# EAGLE schematic untitled (EAGLE 9.6.2)
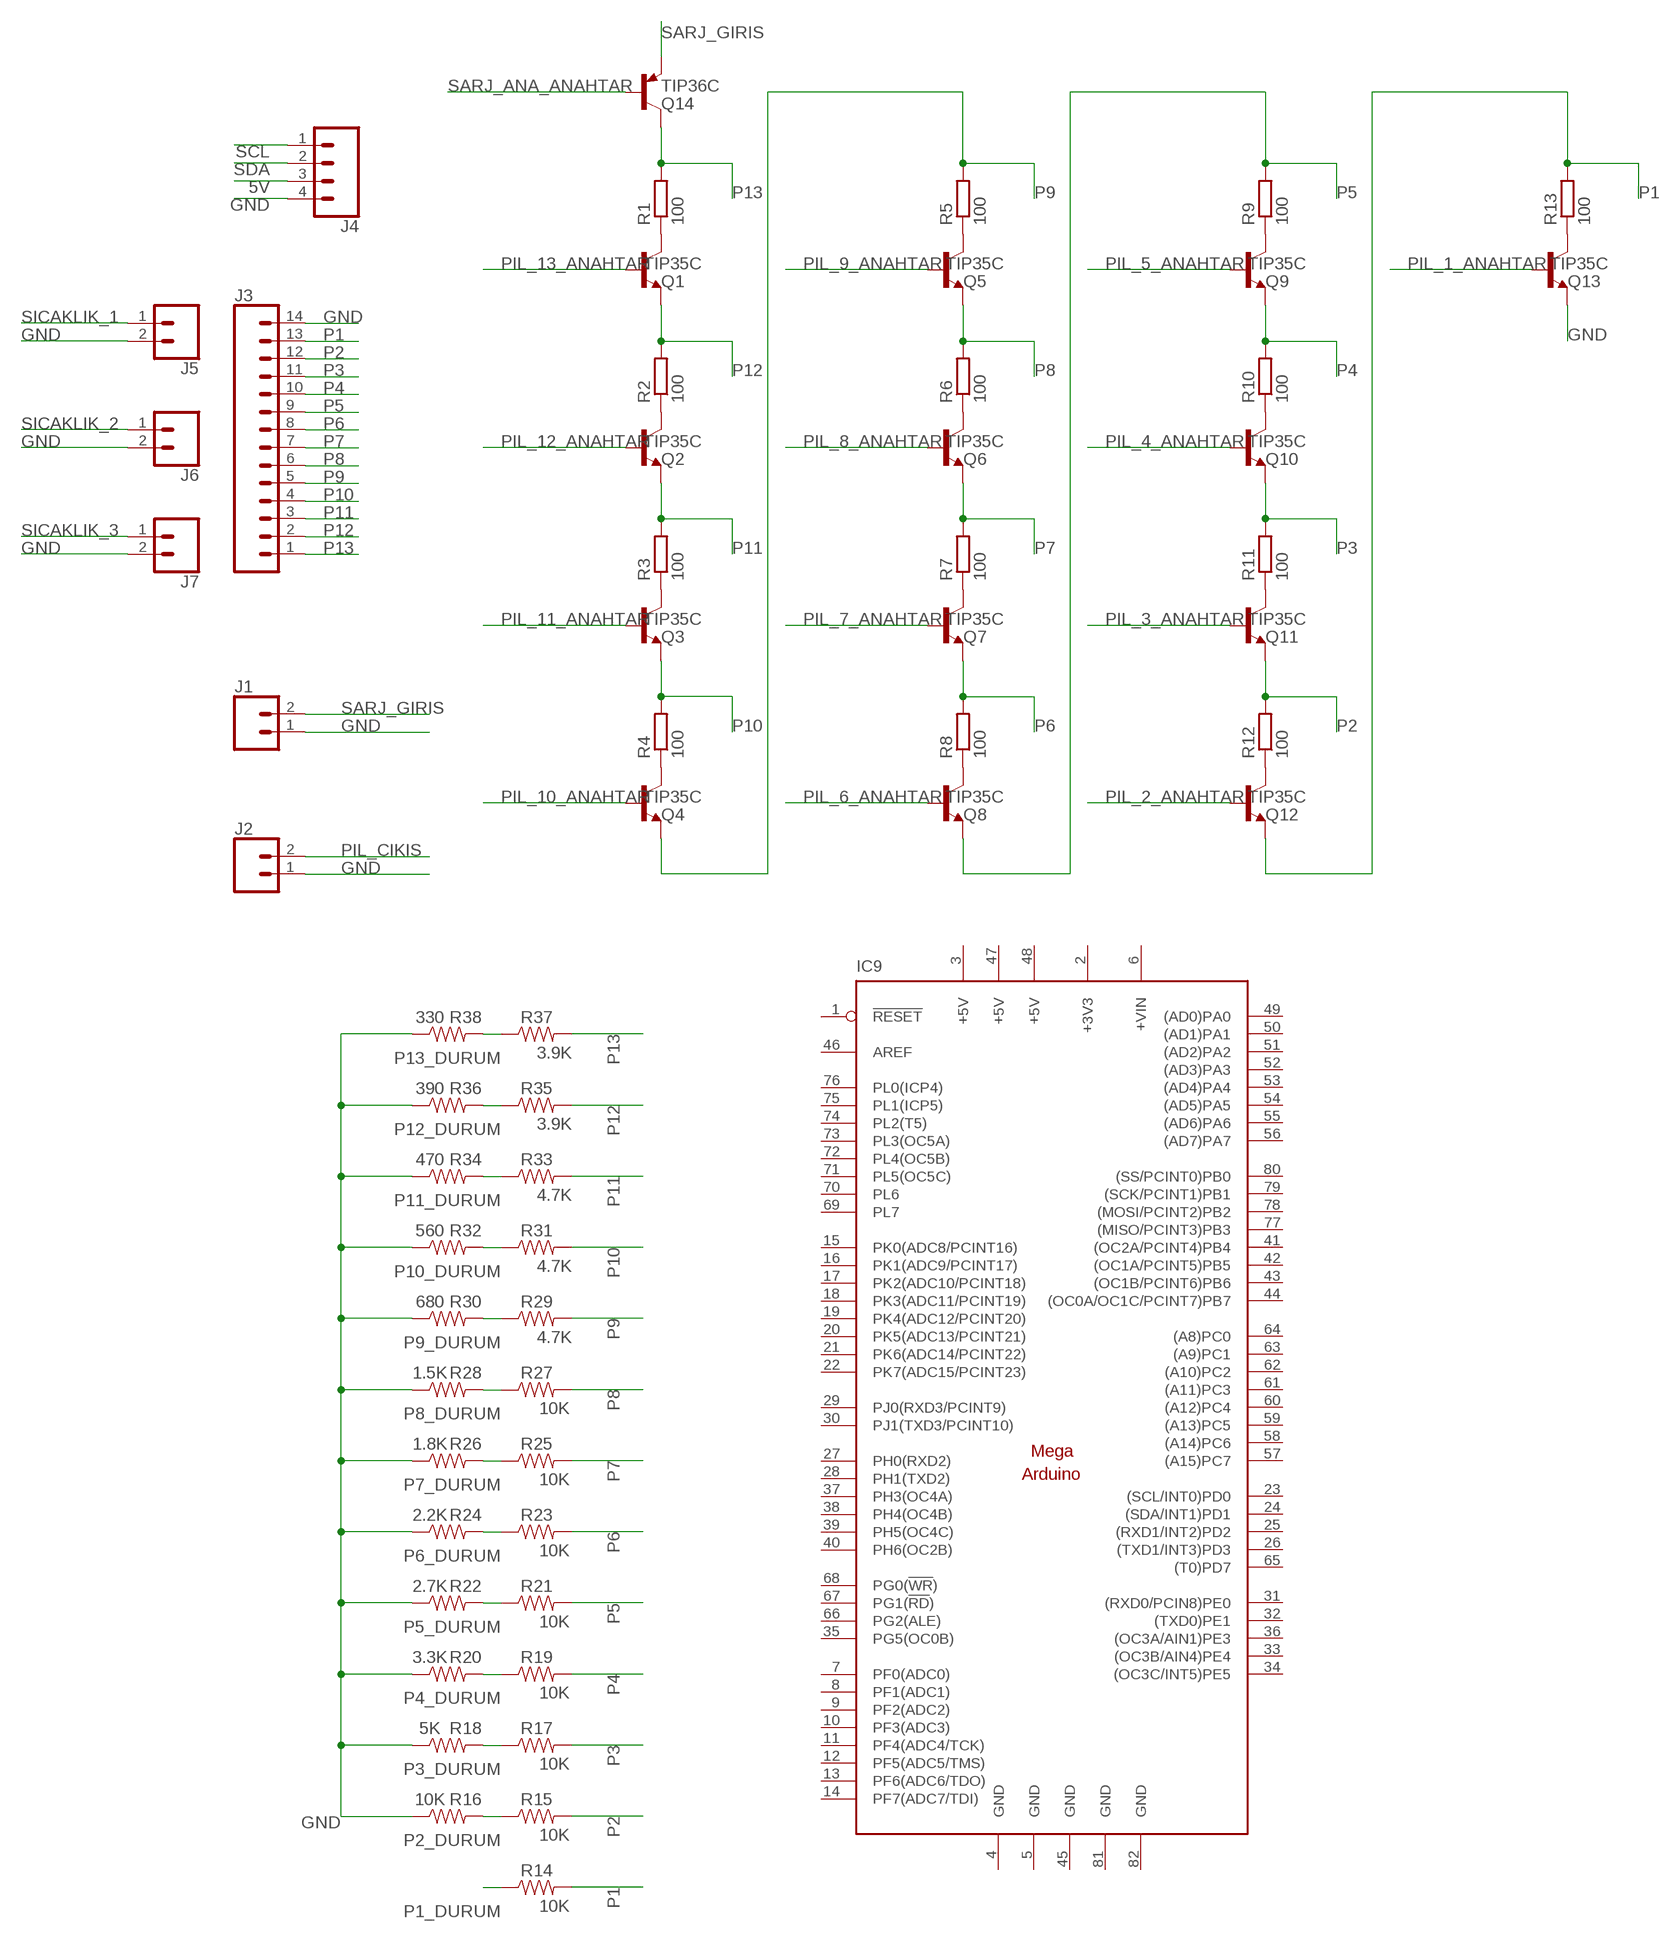
[diagram p0: schematic, sheet 1]

## Parts
IC9  MEGAARDUINO_1  [MEGA_ARDUINO]
J1  CONN_02  [1X02]
J2  CONN_02  [1X02]
J3  CONN_14  [1X14]
J4  CONN_04  [1X04]
J5  CONN_02  [1X02]
J6  CONN_02  [1X02]
J7  CONN_02  [1X02]
Q1  TIP35C  TIP31C  [TO220]
Q2  TIP35C  TIP31C  [TO220]
Q3  TIP35C  TIP31C  [TO220]
Q4  TIP35C  TIP31C  [TO220]
Q5  TIP35C  TIP31C  [TO220]
Q6  TIP35C  TIP31C  [TO220]
Q7  TIP35C  TIP31C  [TO220]
Q8  TIP35C  TIP31C  [TO220]
Q9  TIP35C  TIP31C  [TO220]
Q10  TIP35C  TIP31C  [TO220]
Q11  TIP35C  TIP31C  [TO220]
Q12  TIP35C  TIP31C  [TO220]
Q13  TIP35C  TIP31C  [TO220]
Q14  TIP36C  TIP30  [TO220]
R1  100  R-EU_R2512  [R2512]
R2  100  R-EU_R2512  [R2512]
R3  100  R-EU_R2512  [R2512]
R4  100  R-EU_R2512  [R2512]
R5  100  R-EU_R2512  [R2512]
R6  100  R-EU_R2512  [R2512]
R7  100  R-EU_R2512  [R2512]
R8  100  R-EU_R2512  [R2512]
R9  100  R-EU_R2512  [R2512]
R10  100  R-EU_R2512  [R2512]
R11  100  R-EU_R2512  [R2512]
R12  100  R-EU_R2512  [R2512]
R13  100  R-EU_R2512  [R2512]
R14  10K  RESISTOR0805  [0805]
R15  10K  RESISTOR0805  [0805]
R16  10K  RESISTOR0805  [0805]
R17  10K  RESISTOR0805  [0805]
R18  5K  RESISTOR0805  [0805]
R19  10K  RESISTOR0805  [0805]
R20  3.3K  RESISTOR0805  [0805]
R21  10K  RESISTOR0805  [0805]
R22  2.7K  RESISTOR0805  [0805]
R23  10K  RESISTOR0805  [0805]
R24  2.2K  RESISTOR0805  [0805]
R25  10K  RESISTOR0805  [0805]
R26  1.8K  RESISTOR0805  [0805]
R27  10K  RESISTOR0805  [0805]
R28  1.5K  RESISTOR0805  [0805]
R29  4.7K  RESISTOR0805  [0805]
R30  680  RESISTOR0805  [0805]
R31  4.7K  RESISTOR0805  [0805]
R32  560  RESISTOR0805  [0805]
R33  4.7K  RESISTOR0805  [0805]
R34  470  RESISTOR0805  [0805]
R35  3.9K  RESISTOR0805  [0805]
R36  390  RESISTOR0805  [0805]
R37  3.9K  RESISTOR0805  [0805]
R38  330  RESISTOR0805  [0805]

## Nets
5V: J4.3
GND: J1.1 J2.1 J3.14 J4.4 J5.2 J6.2 J7.2 Q13.3(E) R16.1 R18.1 R20.1 R22.1 R24.1 R26.1 R28.1 R30.1 R32.1 R34.1 R36.1 R38.1
N$1: Q2.2(C) R2.1
N$2: Q3.2(C) R3.1
N$4: Q4.2(C) R4.1
N$7: Q8.2(C) R8.1
N$10: Q7.2(C) R7.1
N$19: Q6.2(C) R6.1
N$22: Q10.2(C) R10.1
N$23: Q11.2(C) R11.1
N$24: Q12.2(C) R12.1
N$26: Q1.2(C) R1.1
N$30: Q5.2(C) R5.1
N$34: Q9.2(C) R9.1
N$38: Q13.2(C) R13.1
P1: J3.13 Q12.3(E) R13.2 R14.2
P1_DURUM: R14.1
P2: J3.12 Q11.3(E) R12.2 R15.2
P2_DURUM: R15.1 R16.2
P3: J3.11 Q10.3(E) R11.2 R17.2
P3_DURUM: R17.1 R18.2
P4: J3.10 Q9.3(E) R10.2 R19.2
P4_DURUM: R19.1 R20.2
P5: J3.9 Q8.3(E) R9.2 R21.2
P5_DURUM: R21.1 R22.2
P6: J3.8 Q7.3(E) R8.2 R23.2
P6_DURUM: R23.1 R24.2
P7: J3.7 Q6.3(E) R7.2 R25.2
P7_DURUM: R25.1 R26.2
P8: J3.6 Q5.3(E) R6.2 R27.2
P8_DURUM: R27.1 R28.2
P9: J3.5 Q4.3(E) R5.2 R29.2
P9_DURUM: R29.1 R30.2
P10: J3.4 Q3.3(E) R4.2 R31.2
P10_DURUM: R31.1 R32.2
P11: J3.3 Q2.3(E) R3.2 R33.2
P11_DURUM: R33.1 R34.2
P12: J3.2 Q1.3(E) R2.2 R35.2
P12_DURUM: R35.1 R36.2
P13: J3.1 Q14.2(C) R1.2 R37.2
P13_DURUM: R37.1 R38.2
PIL_1_ANAHTAR: Q13.1(B)
PIL_2_ANAHTAR: Q12.1(B)
PIL_3_ANAHTAR: Q11.1(B)
PIL_4_ANAHTAR: Q10.1(B)
PIL_5_ANAHTAR: Q9.1(B)
PIL_6_ANAHTAR: Q8.1(B)
PIL_7_ANAHTAR: Q7.1(B)
PIL_8_ANAHTAR: Q6.1(B)
PIL_9_ANAHTAR: Q5.1(B)
PIL_10_ANAHTAR: Q4.1(B)
PIL_11_ANAHTAR: Q3.1(B)
PIL_12_ANAHTAR: Q2.1(B)
PIL_13_ANAHTAR: Q1.1(B)
PIL_CIKIS: J2.2
SARJ_ANA_ANAHTAR: Q14.1(B)
SARJ_GIRIS: J1.2 Q14.3(E)
SCL: J4.1
SDA: J4.2
SICAKLIK_1: J5.1
SICAKLIK_2: J6.1
SICAKLIK_3: J7.1
Unconnected: IC9.1(!RESET) IC9.7(PF0(ADC0)) IC9.8(PF1(ADC1)) IC9.9(PF2(ADC2)) IC9.10(PF3(ADC3)) IC9.11(PF4(ADC4/TCK)) IC9.12(PF5(ADC5/TMS)) IC9.13(PF6(ADC6/TDO)) IC9.14(PF7(ADC7/TDI)) IC9.15(PK0(ADC8/PCINT16)) IC9.16(PK1(ADC9/PCINT17)) IC9.17(PK2(ADC10/PCINT18)) IC9.18(PK3(ADC11/PCINT19)) IC9.19(PK4(ADC12/PCINT20)) IC9.20(PK5(ADC13/PCINT21)) IC9.21(PK6(ADC14/PCINT22)) IC9.22(PK7(ADC15/PCINT23)) IC9.23((SCL/INT0)PD0) IC9.24((SDA/INT1)PD1) IC9.25((RXD1/INT2)PD2) IC9.26((TXD1/INT3)PD3) IC9.27(PH0(RXD2)) IC9.28(PH1(TXD2)) IC9.29(PJ0(RXD3/PCINT9)) IC9.30(PJ1(TXD3/PCINT10)) IC9.31((RXD0/PCIN8)PE0) IC9.32((TXD0)PE1) IC9.33((OC3B/AIN4)PE4) IC9.34((OC3C/INT5)PE5) IC9.35(PG5(OC0B)) IC9.36((OC3A/AIN1)PE3) IC9.37(PH3(OC4A)) IC9.38(PH4(OC4B)) IC9.39(PH5(OC4C)) IC9.40(PH6(OC2B)) IC9.41((OC2A/PCINT4)PB4) IC9.42((OC1A/PCINT5)PB5) IC9.43((OC1B/PCINT6)PB6) IC9.44((OC0A/OC1C/PCINT7)PB7) IC9.46(AREF) IC9.49((AD0)PA0) IC9.50((AD1)PA1) IC9.51((AD2)PA2) IC9.52((AD3)PA3) IC9.53((AD4)PA4) IC9.54((AD5)PA5) IC9.55((AD6)PA6) IC9.56((AD7)PA7) IC9.57((A15)PC7) IC9.58((A14)PC6) IC9.59((A13)PC5) IC9.60((A12)PC4) IC9.61((A11)PC3) IC9.62((A10)PC2) IC9.63((A9)PC1) IC9.64((A8)PC0) IC9.65((T0)PD7) IC9.66(PG2(ALE)) IC9.67(PG1(!RD!)) IC9.68(PG0(!WR!)) IC9.69(PL7) IC9.70(PL6) IC9.71(PL5(OC5C)) IC9.72(PL4(OC5B)) IC9.73(PL3(OC5A)) IC9.74(PL2(T5)) IC9.75(PL1(ICP5)) IC9.76(PL0(ICP4)) IC9.77((MISO/PCINT3)PB3) IC9.78((MOSI/PCINT2)PB2) IC9.79((SCK/PCINT1)PB1) IC9.80((SS/PCINT0)PB0)

## Power pins joined to a net without a drawn wire
+3V3: IC9.2(+3V3)
+5V: IC9.3(+5V) IC9.47(+5V) IC9.48(+5V)
+VIN: IC9.6(+VIN)
GND: IC9.4(GND) IC9.5(GND) IC9.45(GND) IC9.81(GND) IC9.82(GND)

## Library data of the parts
IC9 = arduino:MEGAARDUINO_1: The Arduino Mega is a microcontroller board based on the ATmega1280. - 54 digital input/output pins (of which 14 can be used as PWM outputs) - 16 analog inputs - 4 UARTs (hardware serial ports) - 16 MHz crystal oscillator - USB connection - power jack - ICSP header - reset button It contains everything needed to support the microcontroller; simply connect it to a computer with a USB cable or power it with a AC-to-DC adapter or battery to get started. The Mega is compatible with most shields designed for the Arduino Duemilanove or Diecimila. http://arduino.cc/en/Main/ArduinoBoardMega
J1 J2 J5-J7 = SparkFun-Connectors:CONN_02: Multi connection point. Often used as Generic Header-pin footprint for 0.1 inch spaced/style header connections On any of the 0.1 inch spaced packages, you can populate with these: Break Away Headers - Straight <https://www.sparkfun.com/products/116> (PRT-00116) Break Away Male Headers - Right Angle <https://www.sparkfun.com/products/553> (PRT-00553) Female Headers <https://www.sparkfun.com/products/115> (PRT-00115) Break Away Headers - Machine Pin <https://www.sparkfun.com/products/117> (PRT-00117) Break Away Female Headers - Swiss Machine Pin <https://www.sparkfun.com/products/743> (PRT-00743) For SCREWTERMINALS and SPRING TERMINALS visit here: Screw Terimnals on SparkFun.com <https://www.sparkfun.com/search/results?term=Screw+Terminals> (5mm/3.5mm/2.54mm spacing) This device is also useful as a general connection point to wire up your design to another part of your project. Our various solder wires solder well into these plated through hole pads. Hook-Up Wire - Assortment (Stranded, 22 AWG) <https://www.sparkfun.com/products/11375> (PRT-11375) Hook-Up Wire - Assortment (Solid Core, 22 AWG) <https://www.sparkfun.com/products/11367> (PRT-11367) View the entire wire category on our website here <https://www.sparkfun.com/categories/141> Special notes: Molex polarized connector foot print use with: PRT-08233 with associated crimp pins and housings. 2.54_SCREWTERM for use with PRT-10571. 3.5mm Screw Terminal footprints for PRT-08084 5mm Screw Terminal footprints for use with PRT-08432
J3 = SparkFun-Connectors:CONN_14: Multi connection point. Often used as Generic Header-pin footprint for 0.1 inch spaced/style header connections On any of the 0.1 inch spaced packages, you can populate with these: Break Away Headers - Straight <https://www.sparkfun.com/products/116> (PRT-00116) Break Away Male Headers - Right Angle <https://www.sparkfun.com/products/553> (PRT-00553) Female Headers <https://www.sparkfun.com/products/115> (PRT-00115) Break Away Headers - Machine Pin <https://www.sparkfun.com/products/117> (PRT-00117) Break Away Female Headers - Swiss Machine Pin <https://www.sparkfun.com/products/743> (PRT-00743) For SCREWTERMINALS and SPRING TERMINALS visit here: Screw Terimnals on SparkFun.com <https://www.sparkfun.com/search/results?term=Screw+Terminals> (5mm/3.5mm/2.54mm spacing) This device is also useful as a general connection point to wire up your design to another part of your project. Our various solder wires solder well into these plated through hole pads. Hook-Up Wire - Assortment (Stranded, 22 AWG) <https://www.sparkfun.com/products/11375> (PRT-11375) Hook-Up Wire - Assortment (Solid Core, 22 AWG) <https://www.sparkfun.com/products/11367> (PRT-11367) View the entire wire category on our website here <https://www.sparkfun.com/categories/141> Special notes: Molex polarized connector foot print use with SKU : PRT-08231 with associated crimp pins and housings. 1MM SMD Version SKU: PRT-10208 NOTES ON THE VARIANTS LOCK and LOCK_LONGPADS... This footprint was designed to help hold the alignment of a through-hole component (i.e. 6-pin header) while soldering it into place. You may notice that each hole has been shifted either up or down by 0.005 of an inch from it's more standard position (which is a perfectly straight line). This slight alteration caused the pins (the squares in the middle) to touch the edges of the holes. Because they are alternating, it causes a "brace" to hold the component in place. 0.005 has proven to be the perfect amount of "off-center" position when using our standard breakaway headers. Although looks a little odd when you look at the bare footprint, once you have a header in there, the alteration is very hard to notice. Also,if you push a header all the way into place, it is covered up entirely on the bottom side.
J4 = SparkFun-Connectors:CONN_04: Multi connection point. Often used as Generic Header-pin footprint for 0.1 inch spaced/style header connections On any of the 0.1 inch spaced packages, you can populate with these: Break Away Headers - Straight <https://www.sparkfun.com/products/116> (PRT-00116) Break Away Male Headers - Right Angle <https://www.sparkfun.com/products/553> (PRT-00553) Female Headers <https://www.sparkfun.com/products/115> (PRT-00115) Break Away Headers - Machine Pin <https://www.sparkfun.com/products/117> (PRT-00117) Break Away Female Headers - Swiss Machine Pin <https://www.sparkfun.com/products/743> (PRT-00743) For SCREWTERMINALS and SPRING TERMINALS visit here: Screw Terimnals on SparkFun.com <https://www.sparkfun.com/search/results?term=Screw+Terminals> (5mm/3.5mm/2.54mm spacing) This device is also useful as a general connection point to wire up your design to another part of your project. Our various solder wires solder well into these plated through hole pads. Hook-Up Wire - Assortment (Stranded, 22 AWG) <https://www.sparkfun.com/products/11375> (PRT-11375) Hook-Up Wire - Assortment (Solid Core, 22 AWG) <https://www.sparkfun.com/products/11367> (PRT-11367) View the entire wire category on our website here <https://www.sparkfun.com/categories/141> Special notes: Molex polarized connector foot print use with SKU : PRT-08231 with associated crimp pins and housings. 1MM SMD Version SKU: PRT-10208; PROD_ID: CONN-09696
Q1-Q13 = transistor-npn:TIP31C*: NPN Transistor
Q14 = transistor-pnp:TIP30: PNP Transistor
R1-R13 = resistor:R-EU_: RESISTOR, European symbol
R14-R38 = SparkFun-Resistors:RESISTOR: Generic Resistor Package